# EAGLE design TPS62736 (EAGLE 7.1.0)
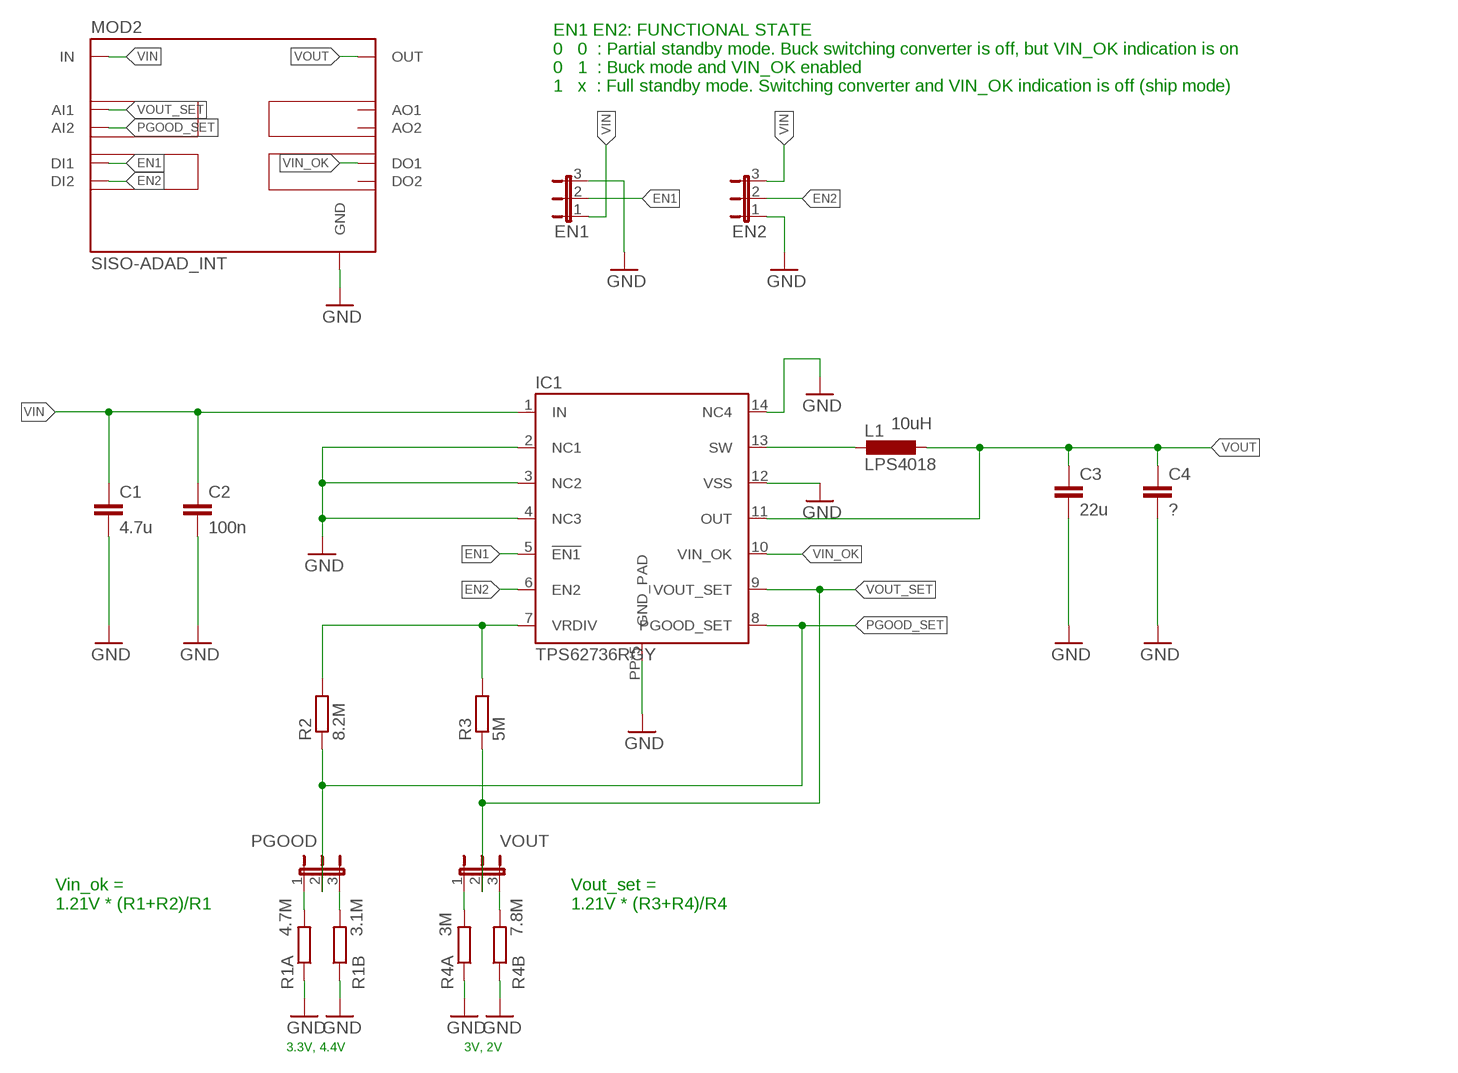
[diagram p0: schematic, sheet 1]

## Parts
C1  4.7u  C-EUC0805  [C0805]
C2  100n  C-EUC0805  [C0805]
C3  22u  C-EUC0805  [C0805]
C4  ?  C-EUC0805  [C0805]
EN1  JP2E  [JP2]
EN2  JP2E  [JP2]
IC1  TPS62736RGY  [S-PVQFN-N14]
L1  LPS4018  [LPS4018]
MOD2  SISO-ADAD_INT  [SISO-ADAD]
PGOOD  JP2E  [JP2]
R1A  4.7M  R-EU_R0805  [R0805]
R1B  3.1M  R-EU_R0805  [R0805]
R2  8.2M  R-EU_R0805  [R0805]
R3  5M  R-EU_R0805  [R0805]
R4A  3M  R-EU_R0805  [R0805]
R4B  7.8M  R-EU_R0805  [R0805]
VOUT  JP2E  [JP2]

## Nets
EN1: EN1.2 IC1.5(!EN1) MOD2.DI1
EN2: EN2.2 IC1.6(EN2) MOD2.DI2
GND: C1.2 C2.2 C3.2 C4.2 EN1.3 EN2.1 IC1.2(NC1) IC1.3(NC2) IC1.4(NC3) IC1.12(VSS) IC1.14(NC4) IC1.PP(GND_PAD) IC1.PP@1(GND_PAD) IC1.PP@2(GND_PAD) IC1.PP@3(GND_PAD) IC1.PP@4(GND_PAD) MOD2.GND1(GND) MOD2.GND2(GND) MOD2.GND3(GND) MOD2.GND4(GND) R1A.1 R1B.1 R4A.1 R4B.1
N$2: IC1.7(VRDIV) R2.2 R3.2
N$3: IC1.13(SW) L1.1
N$4: R4A.2 VOUT.1
N$5: R4B.2 VOUT.3
N$10: PGOOD.1 R1A.2
N$11: PGOOD.3 R1B.2
PGOOD_SET: IC1.8(PGOOD_SET) MOD2.AI2 PGOOD.2 R2.1
VIN: C1.1 C2.1 EN1.1 EN2.3 IC1.1(IN) MOD2.IN1(IN) MOD2.IN2(IN) MOD2.IN3(IN) MOD2.IN4(IN)
VIN_OK: IC1.10(VIN_OK) MOD2.DO1
VOUT: C3.1 C4.1 IC1.11(OUT) L1.2 MOD2.OUT1_1(OUT) MOD2.OUT1_2(OUT) MOD2.OUT1_3(OUT) MOD2.OUT1_4(OUT)
VOUT_SET: IC1.9(VOUT_SET) MOD2.AI1 R3.1 VOUT.2
Unconnected: MOD2.AO1 MOD2.AO2 MOD2.DO2

## Notes on the sheet
- EN1 EN2: FUNCTIONAL STATE
  0   0  : Partial standby mode. Buck switching converter is off, but VIN_OK indication is on
  0   1  : Buck mode and VIN_OK enabled
  1   x  : Full standby mode. Switching converter and VIN_OK indication is off (ship mode)
- 10uH
- Vin_ok =
  1.21V * (R1+R2)/R1
- Vout_set =
  1.21V * (R3+R4)/R4
- 3.3V, 4.4V | 3V, 2V

## Library data of the parts
C1-C4 = rcl:C-EU: CAPACITOR, European symbol
EN1 EN2 PGOOD VOUT = Jumper_mod:JP2E: JUMPER
IC1 = TPS62736:TPS62736RGY
L1 = LPS4018:LPS4018: COILCRAFT
MOD2 = AllModules:SISO-ADAD_INT
R1A R1B R2 R3 R4A R4B = rcl:R-EU_: RESISTOR, European symbol

## Board
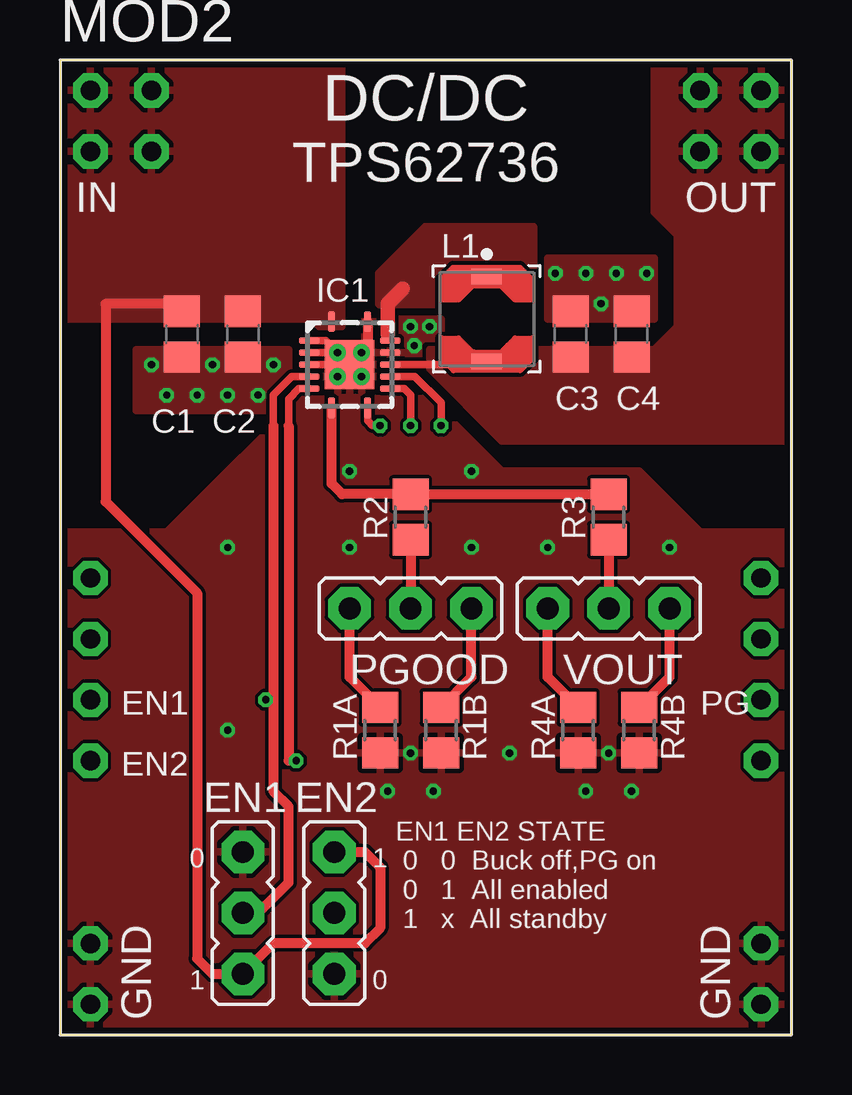
[diagram p1: board, top side]
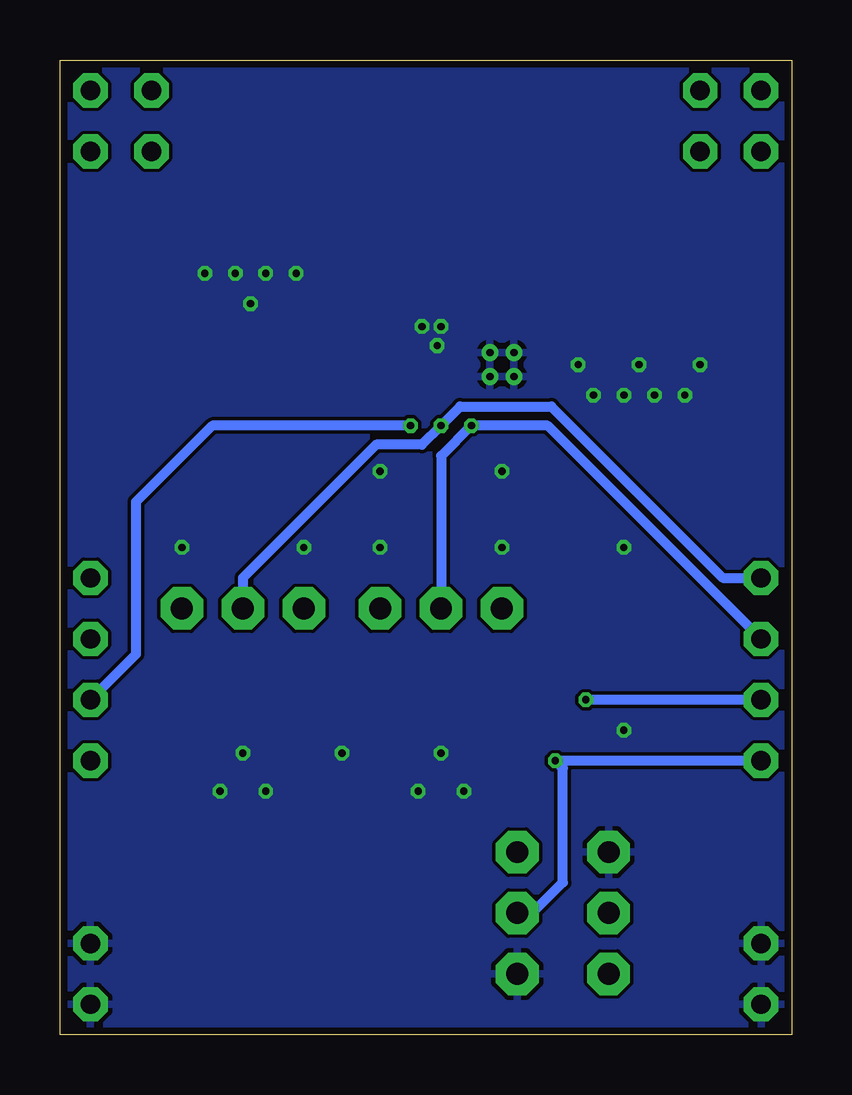
[diagram p2: board, bottom side, seen from below]

Size 30.48 x 40.64 mm. Coordinates in mm from the lower left corner, seen from the top.
Outline: 0,0 30.48,0 30.48,40.64 0,40.64 0,0
Copper layers (1*16): Top 0.035mm / dielectric 1.5mm / Bottom 0.035mm
Design rules "PCB-POOL Standard *": minimum track width 0.15mm, minimum drill 0.3mm, track to track 0.15mm, track to pad 0.15mm, pad to pad 0.15mm, via to via 0.15mm, smd to smd 0.15mm, copper to edge 0.3mm, drill to drill 0.2mm, minimum pad ring 0.2mm, minimum via ring 0.15mm, stop-mask expansion 0.075mm, vias tented up to drill 0mil, thermal gap 0.2mm

### Footprints (pad centres in the part's own frame; a part is rotated, then mirrored left to right if it is on the bottom)
C0805 = smd 1.3 x 1.5: 1 -0.95,0; 2 0.95,0
JP2 = drill 0.914 pad 1.778 octagon: 1 -2.54,0; 2 0,0; 3 2.54,0
S-PVQFN-N14 = smd 0.85 x 0.28: 1 -1.8,-0.75; 7 1.8,-0.75; 8 1.8,0.75; 14 -1.8,0.75 | smd 0.28 x 0.85: 2 -1,-1.688; 3 -0.5,-1.688; 4 0,-1.688; 5 0.5,-1.688; 6 1,-1.688; 9 1,1.7; 10 0.5,1.7; 11 0,1.7; 12 -0.5,1.7; 13 -1,1.7 | smd 2.05 x 2.05: PP 0,0 | drill 0.3 pad 0.4: PP@1 -0.5,0.5; PP@2 0.5,0.5; PP@3 -0.5,-0.5; PP@4 0.5,-0.5
LPS4018 = smd 0.635 x 1.27: 1 -1.765,0; 2 1.765,0
SISO-ADAD = drill 0.8 pad 1.422 octagon: AI1 0,-20.32; AI2 0,-22.86; AO1 27.94,-20.32; AO2 27.94,-22.86; DI1 0,-25.4; DI2 0,-27.94; DO1 27.94,-25.4; DO2 27.94,-27.94; GND1 0,-38.1; GND2 0,-35.56; GND3 27.94,-35.56; GND4 27.94,-38.1; IN1 0,0; IN2 0,-2.54; IN3 2.54,0; IN4 2.54,-2.54; OUT1_1 25.4,0; OUT1_2 25.4,-2.54; OUT1_3 27.94,0; OUT1_4 27.94,-2.54
R0805 = smd 1.3 x 1.5: 1 -0.95,0; 2 0.95,0

### Placement (x,y rotation side)
C1  5.08,29.21 270 top
C2  7.62,29.21 270 top
C3  21.27,29.21 90 top
C4  23.81,29.21 90 top
EN1  7.62,5.08 90 top
EN2  11.43,5.08 90 top
IC1  12.06,27.94 270 top
L1  17.78,29.84 270 top
MOD2  1.27,39.37 0 top
PGOOD  14.61,17.78 0 top
R1A  13.34,12.7 90 top
R1B  15.88,12.7 90 top
R2  14.61,21.59 90 top
R3  22.86,21.59 90 top
R4A  21.59,12.7 90 top
R4B  24.13,12.7 90 top
VOUT  22.86,17.78 0 top

### Tracks (layer width: path | path; a pad name or v marks a point on that pad's centre or on a via)
EN1  (via drill 0.3)
  Top 0.305: IC1.5 9.66,27.44 8.89,26.67 8.89,25.4
  Top 0.406: 8.89,25.4 8.89,13.97 | v8.57,13.97 8.89,13.97 | 8.89,13.97 8.89,10.16 9.53,9.53 9.53,6.35 8.26,5.08 EN1.2
  Bottom 0.406: MOD2.DI1 v8.57,13.97
EN2  (via drill 0.3)
  Top 0.305: IC1.6 9.95,26.94 9.53,26.51 9.53,25.4
  Top 0.406: 9.53,25.4 9.53,11.43 v9.84,11.43
  Bottom 0.406: MOD2.DI2 v9.84,11.43 9.53,11.11 9.53,6.35 10.79,5.08 EN2.2
GND  (via drill 0.3)
  Top 0.305: IC1.3 IC1.PP@3 | IC1.2 11.06,28.94 IC1.PP@3 | IC1.4 11.56,27.94 IC1.PP@3
  Top 0.406: IC1.14 12.81,28.69 IC1.PP@1
  other vias: 13.65,10.16 15.56,10.16 20.64,31.75 21.91,31.75 23.18,31.75 24.45,31.75 6.99,26.67 8.26,26.67 5.71,26.67 4.45,26.67 23.81,10.16 21.91,10.16 14.76,28.73 14.61,29.53 15.4,29.53 6.35,27.94 3.81,27.94 8.89,27.94 22.54,30.48 14.61,11.75 22.86,11.75 17.14,20.32 12.06,20.32 20.32,20.32 6.99,20.32 12.06,23.5 25.4,20.32 17.14,23.5 6.99,12.7 18.73,11.75
  pour Bottom: -0.64,41.27 31.11,41.27 31.11,-0.63 -0.64,-0.63
  pour Top (no thermals): 20.32,29.84 24.77,29.84 24.77,32.38 20.32,32.38
  pour Top (no thermals): 3.17,26.04 9.53,26.04 9.53,28.58 3.17,28.58
  pour Top (rank 2): 0,0 30.48,0 30.48,20.96 26.67,20.96 24.13,23.5 18.41,23.5 15.88,26.04 15.88,29.84 12.7,29.84 12.7,28.58 10.79,28.58 10.79,27.3 4.45,20.96 0,20.96
N$2
  Top 0.406: R3.2 R2.2 11.75,22.54 11.31,22.98 IC1.7
N$3
  Top 0.254: IC1.13 13.65,29.05 13.65,29.21
  Top 0.61: 13.65,29.21 13.65,30.48 14.29,31.12
  pour Top (rank 2, no thermals): 13.34,31.75 15.24,33.66 19.68,33.66 19.68,30.48 13.34,30.48
N$4
  Top 0.406: R4A.2 20.32,14.92 VOUT.1
N$5
  Top 0.406: R4B.2 25.4,14.92 VOUT.3
N$10
  Top 0.406: R1A.2 12.06,14.92 PGOOD.1
N$11
  Top 0.406: R1B.2 17.14,14.92 PGOOD.3
PGOOD_SET  (via drill 0.3)
  Top 0.305: IC1.8 12.81,25.6 13.02,25.4 v13.34,25.4
  Top 0.406: R2.1 PGOOD.2
  Bottom 0.406: PGOOD.2 14.61,24.13 v13.34,25.4 10.16,25.4 MOD2.AI2
VIN
  Top 0.406: C1.1 4.76,30.48 1.91,30.48 1.91,22.23 5.71,18.41 5.71,3.17 6.35,2.54 EN1.1 8.89,3.81 12.7,3.81 13.34,4.45 13.34,6.98 12.7,7.62 EN2.3
  pour Top (no thermals): 0,34.29 11.75,34.29 11.75,29.53 10.79,29.53 10.48,29.84 0,29.84
  pour Top: 0,40.64 11.75,40.64 11.75,34.29 0,34.29
VIN_OK  (via drill 0.3)
  Top 0.305: IC1.10 14.79,27.44 15.88,26.35 v15.88,25.4
  Bottom 0.406: v15.88,25.4 24.13,25.4 27.3,22.23 27.3,15.88 MOD2.DO1
VOUT
  Top 0.305: IC1.11 17.46,27.94
  Top 0.406: 17.46,27.94 17.78,27.94 L1.2
  pour Top (no thermals): 30.48,24.77 18.41,24.77 15.4,27.78 15.4,28.58 24.77,28.58 25.72,29.53 25.72,33.34 24.77,34.29 30.48,34.29
  pour Top: 24.77,34.29 24.77,40.64 30.48,40.64 30.48,34.29
VOUT_SET  (via drill 0.3)
  Top 0.305: IC1.9 14.34,26.94 14.61,26.67 v14.61,25.4
  Top 0.406: R3.1 VOUT.2
  Bottom 0.406: MOD2.AI1 2.86,19.05 10,26.19 13.81,26.19 v14.61,25.4 15.4,24.61 17.3,24.61 22.86,19.05 VOUT.2

### Text on the board
tNames: DC/DC | TPS62736 | EN1 | PG | EN2 | 0 | 1 | EN1 EN2 STATE / 0 0 Buck off,PG on / 0 1 All enabled / 1 x All standby | 1 | 0
bStop: Jan Kokert / 26.01.2016